# EAGLE design FPGA-Blitter (EAGLE 6.5.0)
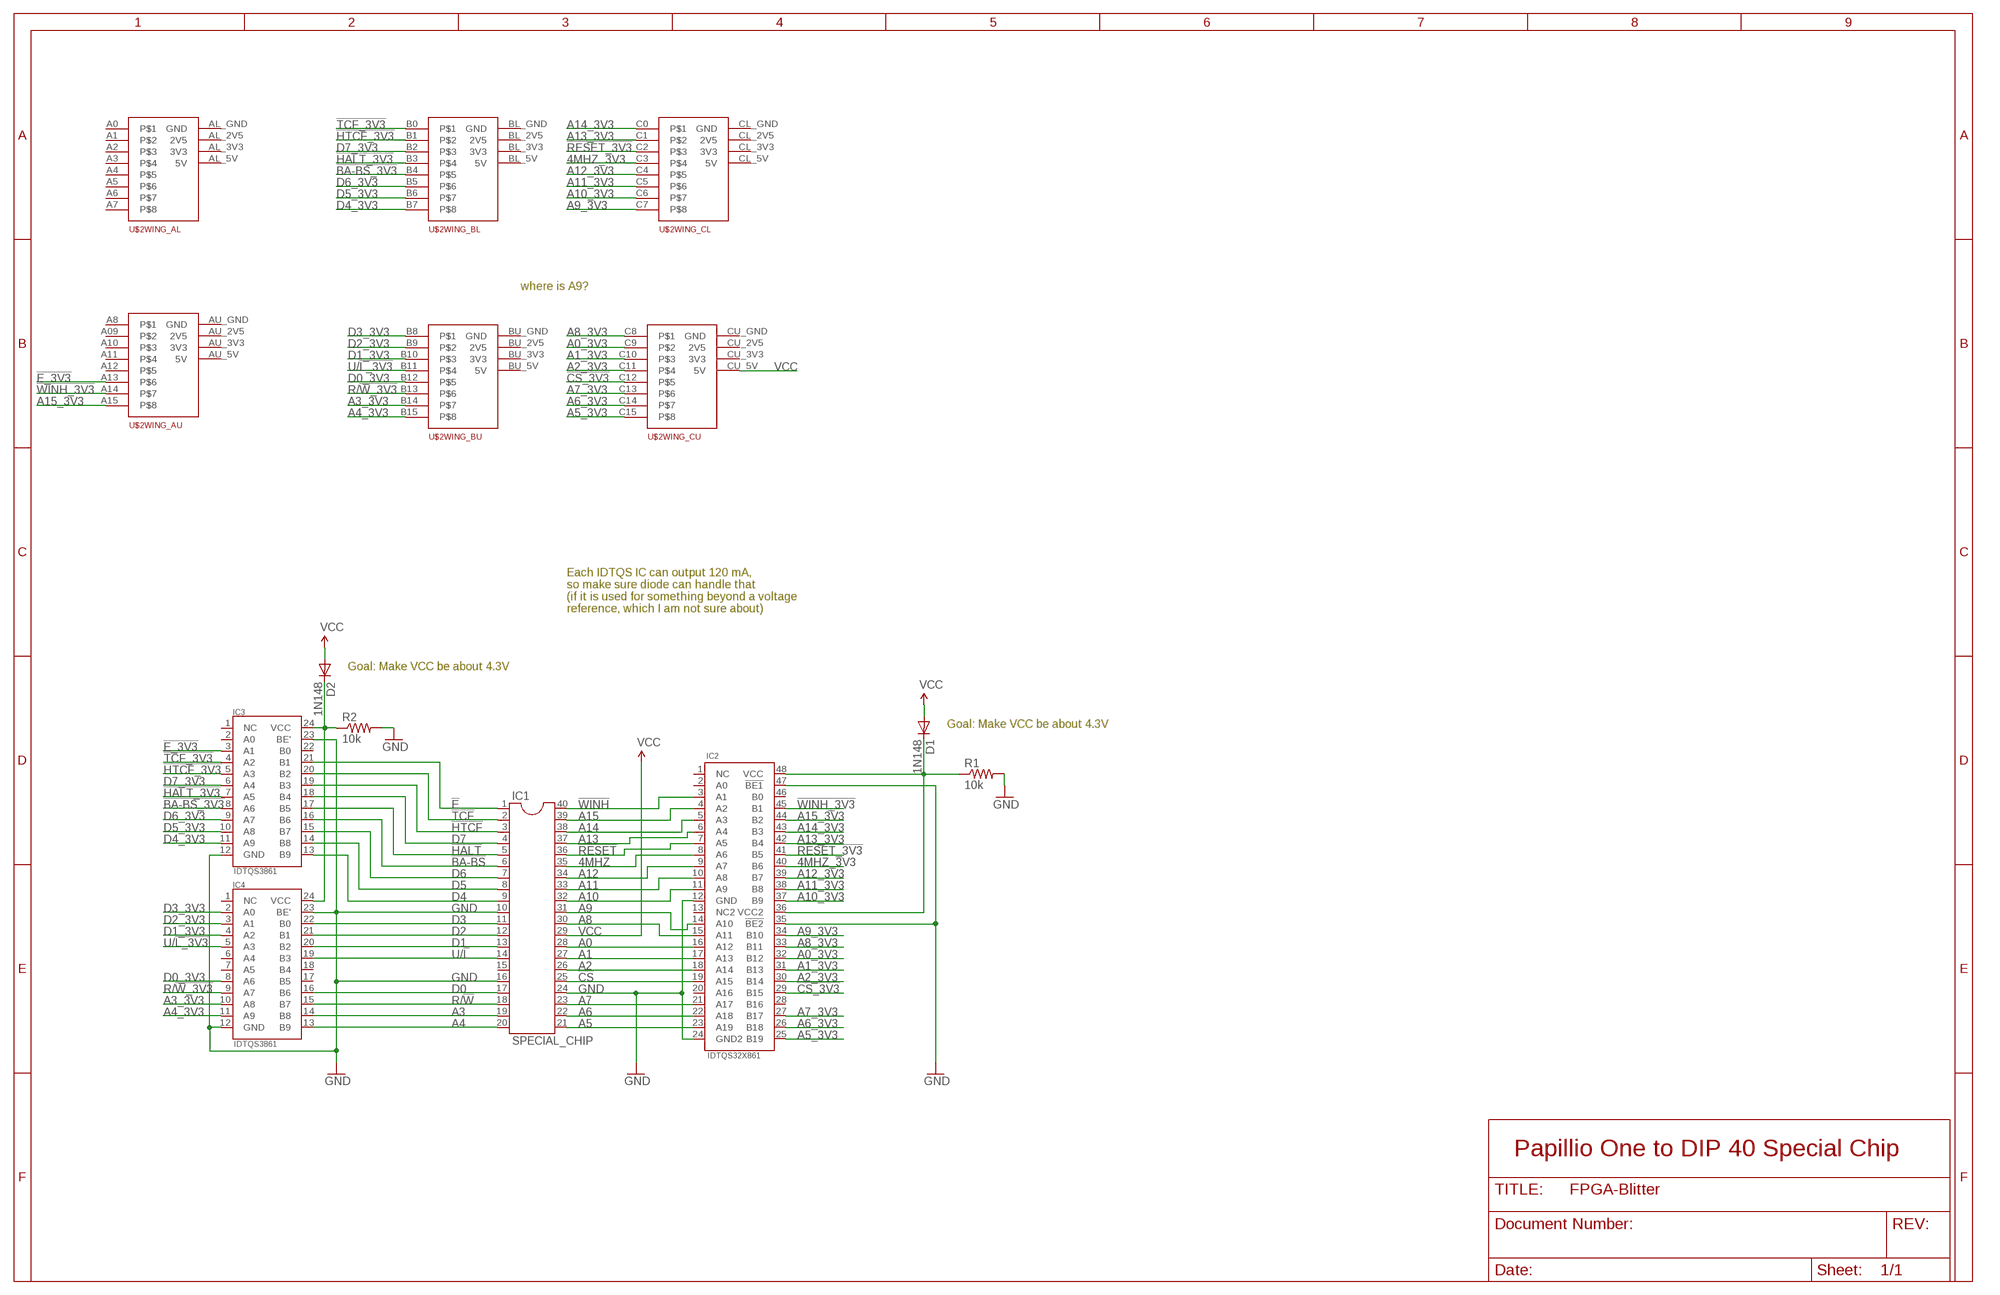
[diagram p0: schematic, sheet 1]

## Parts
D1  1N148  DIODE1N4148  [DIODE-1N4148]
D2  1N148  DIODE1N4148  [DIODE-1N4148]
IC1  SPECIAL_CHIP  DIL40  [DIL40]
IC2  IDTQS32X861  [QVSOP-DJG48-IDT]
IC3  IDTQS3861  [TSSOP24]
IC4  IDTQS3861  [TSSOP24]
R1  10k  RESISTOR1206  [1206]
R2  10k  RESISTOR1206  [1206]
U$2  PAPILIO48  [PAPILIO48]

## Nets
4MHZ: IC1.35 IC2.8(A6)
4MHZ_3V3: IC2.40(B6) U$2.C3
!BA-BS: IC1.6 IC3.16(B6)
!BA-BS_3V3: IC3.8(A6) U$2.B4
!CS: IC1.25 IC2.19(A15)
!CS_3V3: IC2.29(B15) U$2.C12
!E: IC1.1 IC3.21(B1)
!E_3V3: IC3.3(A1) U$2.A13
!HALT: IC1.5 IC3.17(B5)
!HALT_3V3: IC3.7(A5) U$2.B3
!HTCF: IC1.3 IC3.19(B3)
!HTCF_3V3: IC3.5(A3) U$2.B1
!RESET: IC1.36 IC2.7(A5)
!RESET_3V3: IC2.41(B5) U$2.C2
!TCF: IC1.2 IC3.20(B2)
!TCF_3V3: IC3.4(A2) U$2.B0
!WINH: IC1.40 IC2.3(A1)
!WINH_3V3: IC2.45(B1) U$2.A14
A0: IC1.28 IC2.16(A12)
A0_3V3: IC2.32(B12) U$2.C9
A1: IC1.27 IC2.17(A13)
A1_3V3: IC2.31(B13) U$2.C10
A2: IC1.26 IC2.18(A14)
A2_3V3: IC2.30(B14) U$2.C11
A3: IC1.19 IC4.14(B8)
A3_3V3: IC4.10(A8) U$2.B14
A4: IC1.20 IC4.13(B9)
A4_3V3: IC4.11(A9) U$2.B15
A5: IC1.21 IC2.23(A19)
A5_3V3: IC2.25(B19) U$2.C15
A6: IC1.22 IC2.22(A18)
A6_3V3: IC2.26(B18) U$2.C14
A7: IC1.23 IC2.21(A17)
A7_3V3: IC2.27(B17) U$2.C13
A8: IC1.30 IC2.15(A11)
A8_3V3: IC2.33(B11) U$2.C8
A9: IC1.31 IC2.14(A10)
A9_3V3: IC2.34(B10) U$2.C7
A10: IC1.32 IC2.11(A9)
A10_3V3: IC2.37(B9) U$2.C6
A11: IC1.33 IC2.10(A8)
A11_3V3: IC2.38(B8) U$2.C5
A12: IC1.34 IC2.9(A7)
A12_3V3: IC2.39(B7) U$2.C4
A13: IC1.37 IC2.6(A4)
A13_3V3: IC2.42(B4) U$2.C1
A14: IC1.38 IC2.5(A3)
A14_3V3: IC2.43(B3) U$2.C0
A15: IC1.39 IC2.4(A2)
A15_3V3: IC2.44(B2) U$2.A15
D0: IC1.17 IC4.16(B6)
D0_3V3: IC4.8(A6) U$2.B12
D1: IC1.13 IC4.20(B2)
D1_3V3: IC4.4(A2) U$2.B10
D2: IC1.12 IC4.21(B1)
D2_3V3: IC4.3(A1) U$2.B9
D3: IC1.11 IC4.22(B0)
D3_3V3: IC4.2(A0) U$2.B8
D4: IC1.9 IC3.13(B9)
D4_3V3: IC3.11(A9) U$2.B7
D5: IC1.8 IC3.14(B8)
D5_3V3: IC3.10(A8) U$2.B6
D6: IC1.7 IC3.15(B7)
D6_3V3: IC3.9(A7) U$2.B5
D7: IC1.4 IC3.18(B4)
D7_3V3: IC3.6(A4) U$2.B2
GND: IC1.10 IC1.16 IC1.24 IC2.12(GND) IC2.24(GND2) IC2.35(!BE2) IC2.47(!BE1) IC3.12(GND) IC3.23(BE') IC4.12(GND) IC4.23(BE') R1.2 R2.2
N$4: D2.C IC3.24(VCC) IC4.24(VCC) R2.1
N$8: D1.C IC2.36(VCC2) IC2.48(VCC) R1.1
R/!W: IC1.18 IC4.15(B7)
R/!W_3V3: IC4.9(A7) U$2.B13
U/!L: IC1.14 IC4.19(B3)
U/!L_3V3: IC4.5(A3) U$2.B11
VCC: D1.A D2.A IC1.29 U$2.CU_5V(WING_CU:5V)
Unconnected: IC1.15 IC2.1(NC) IC2.2(A0) IC2.13(NC2) IC2.20(A16) IC2.28(B16) IC2.46(B0) IC3.1(NC) IC3.2(A0) IC3.22(B0) IC4.1(NC) IC4.6(A4) IC4.7(A5) IC4.17(B5) IC4.18(B4) U$2.A0 U$2.A1 U$2.A2 U$2.A3 U$2.A4 U$2.A5 U$2.A6 U$2.A7 U$2.A8 U$2.A09 U$2.A10 U$2.A11 U$2.A12 U$2.AL_2V5(WING_AL:2V5) U$2.AL_3V3(WING_AL:3V3) U$2.AL_5V(WING_AL:5V) U$2.AL_GND(WING_AL:GND) U$2.AU_2V5(WING_AU:2V5) U$2.AU_3V3(WING_AU:3V3) U$2.AU_5V(WING_AU:5V) U$2.AU_GND(WING_AU:GND) U$2.BL_2V5(WING_BL:2V5) U$2.BL_3V3(WING_BL:3V3) U$2.BL_5V(WING_BL:5V) U$2.BL_GND(WING_BL:GND) U$2.BU_2V5(WING_BU:2V5) U$2.BU_3V3(WING_BU:3V3) U$2.BU_5V(WING_BU:5V) U$2.BU_GND(WING_BU:GND) U$2.CL_2V5(WING_CL:2V5) U$2.CL_3V3(WING_CL:3V3) U$2.CL_5V(WING_CL:5V) U$2.CL_GND(WING_CL:GND) U$2.CU_2V5(WING_CU:2V5) U$2.CU_3V3(WING_CU:3V3) U$2.CU_GND(WING_CU:GND)

## Notes on the sheet
- where is A9?
- Each IDTQS IC can output 120 mA,
  so make sure diode can handle that
  (if it is used for something beyond a voltage
  reference, which I am not sure about)
- Goal: Make VCC be about 4.3V
- Goal: Make VCC be about 4.3V
- Papillio One to DIP 40 Special Chip

## Library data of the parts
D1 D2 = SparkFun:DIODE: Diode These are standard reverse protection diodes and small signal diodes. SMA package can handle up to about 1A. SOD-323 can handle about 200mA. What the SOD-323 package when ordering, there are some mfgs out there that are 5-pin packages.
IC1 = ic-package:DIL40: Dual In Line
IC2 = mpo:IDTQS32X861
IC3 IC4 = mpo:IDTQS3861
R1 R2 = SparkFun:RESISTOR: Resistor Basic schematic elements and footprints for 0603, 1206, and PTH resistors.
U$2 = atom_pap:PAPILIO48: Papilio One Full Wing, Created by AtomSoft.

## Net classes
0 default: width 0.178 mm, drill 0.381 mm, clearance 0.178 mm
1 Power: width 0.813 mm, drill 0.381 mm, clearance 0.178 mm

## Board
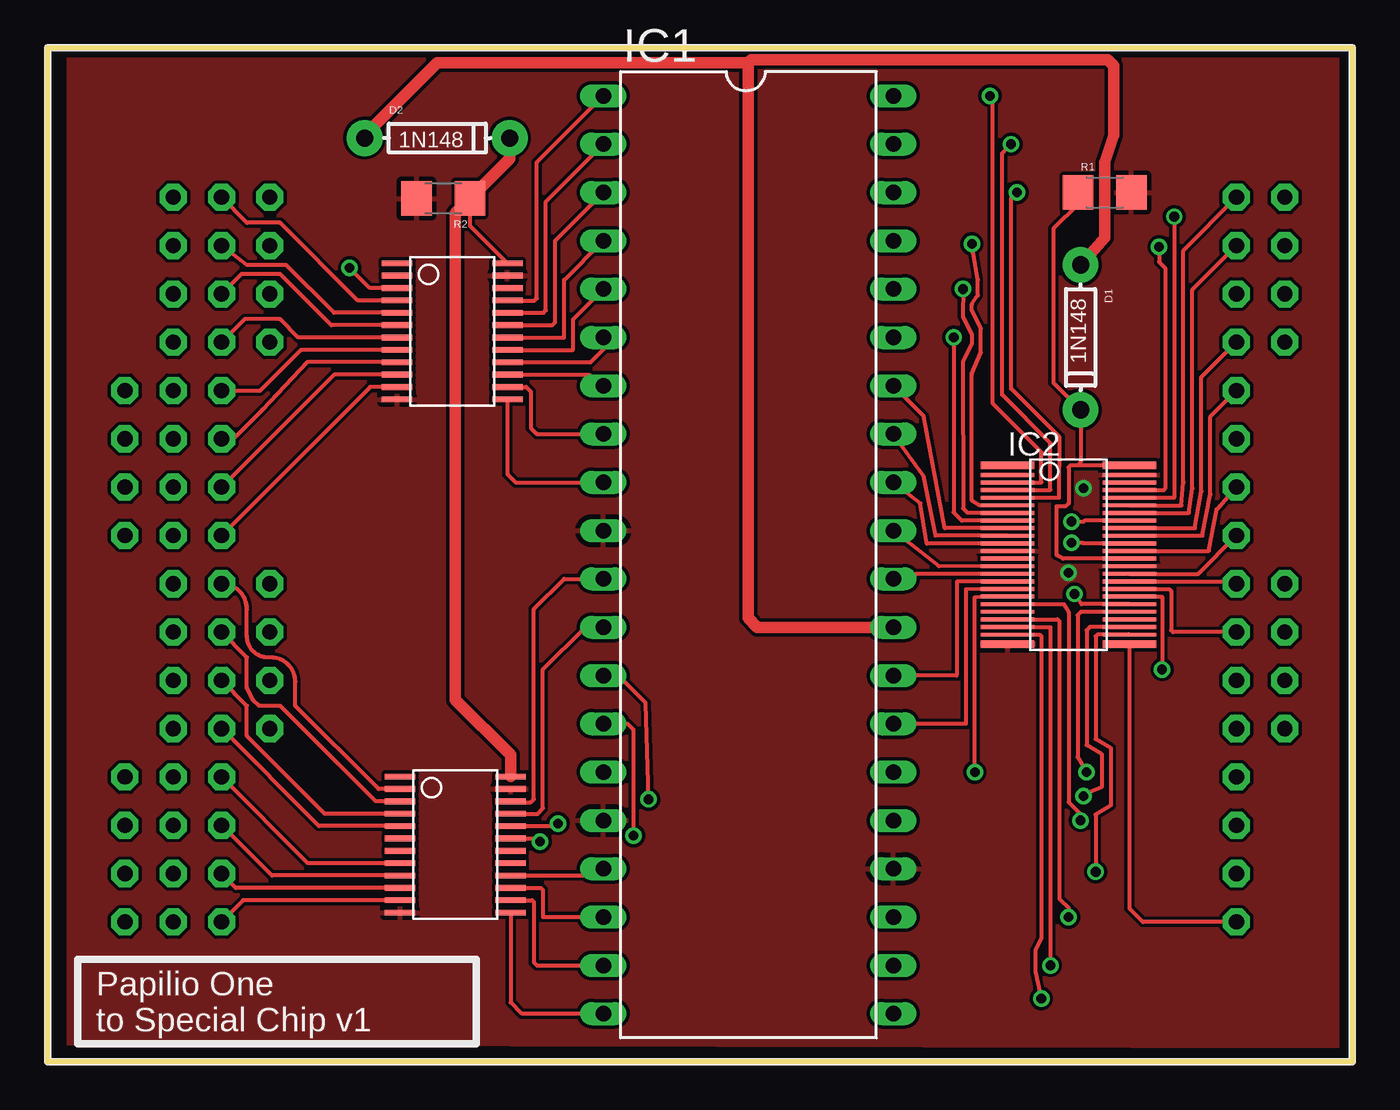
[diagram p1: board, top side]
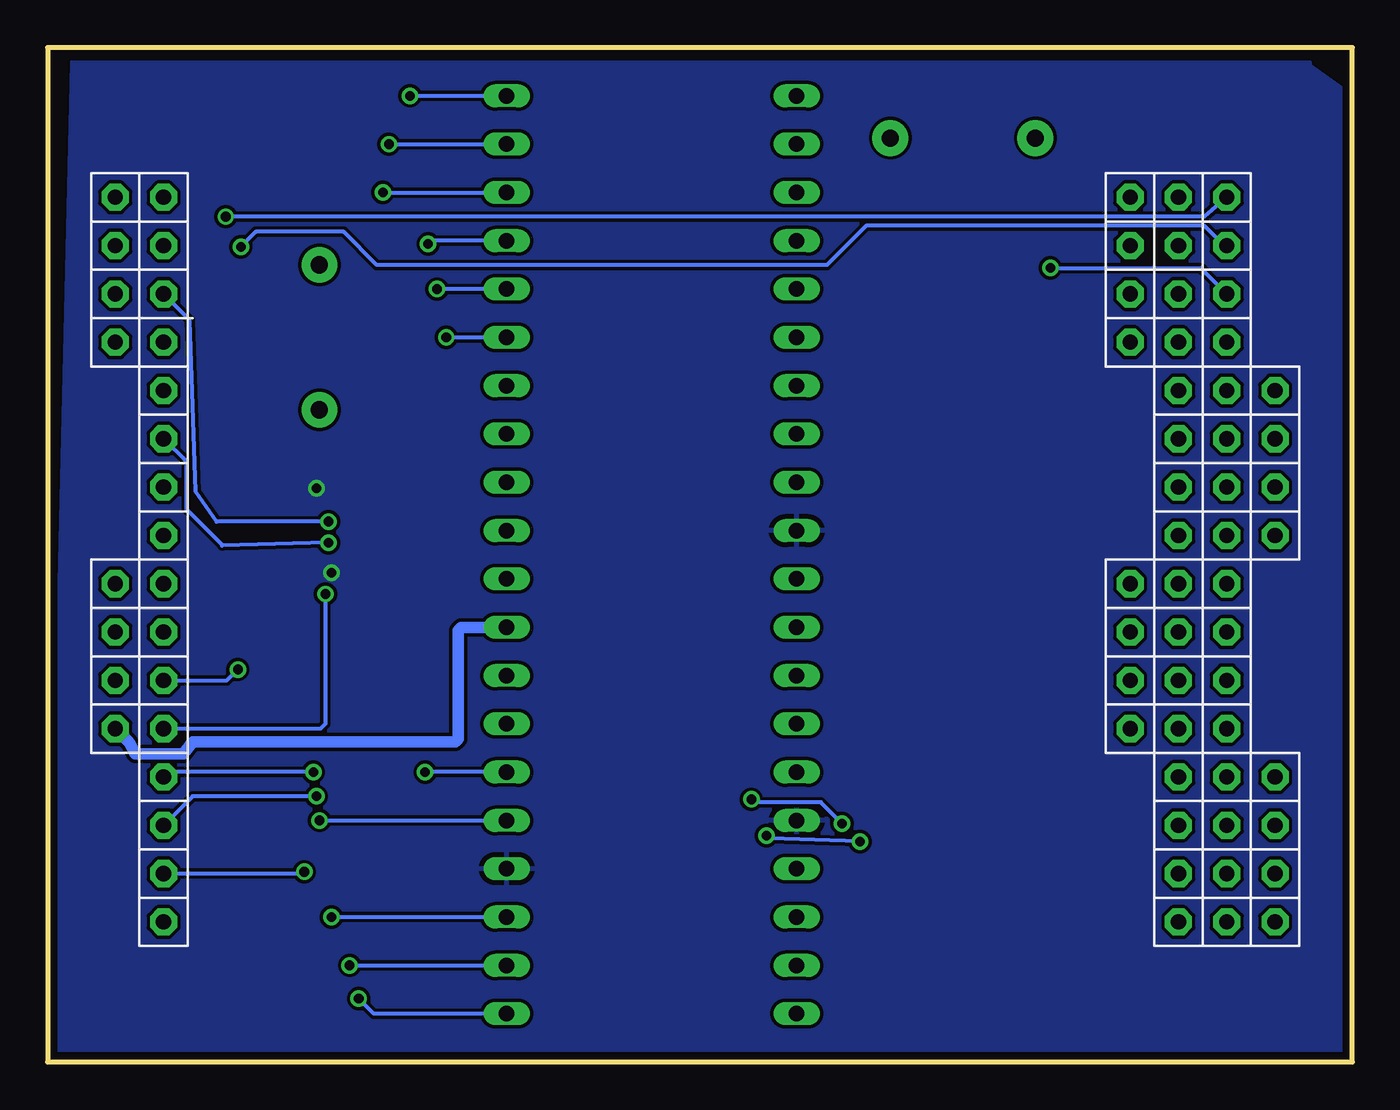
[diagram p2: board, bottom side, seen from below]

Size 68.58 x 53.34 mm. Coordinates in mm from the lower left corner, seen from the top.
Outline: 0,53.34 68.58,53.34 68.58,0 0,0 0,53.34
Copper layers (1*16): Top 0.0356mm / dielectric 1.5011mm / Bottom 0.0356mm
Design rules "OSHParkLaenPCBOrder": minimum track width 6mil, minimum drill 13mil, track to track 6mil, track to pad 6mil, pad to pad 6mil, via to via 6mil, smd to smd 6mil, copper to edge 15mil, drill to drill 6mil, minimum pad ring 7mil, minimum via ring 7mil, stop-mask expansion 3mil, vias tented up to drill 0mil, thermal gap 10mil

### Footprints (pad centres in the part's own frame; a part is rotated, then mirrored left to right if it is on the bottom)
DIODE-1N4148 = drill 0.9 pad 1.88: A -3.81,0; C 3.81,0
DIL40 = drill 0.813 long: 1 -24.13,-7.62; 2 -21.59,-7.62; 3 -19.05,-7.62; 4 -16.51,-7.62; 5 -13.97,-7.62; 6 -11.43,-7.62; 7 -8.89,-7.62; 8 -6.35,-7.62; 9 -3.81,-7.62; 10 -1.27,-7.62; 11 1.27,-7.62; 12 3.81,-7.62; 13 6.35,-7.62; 14 8.89,-7.62; 15 11.43,-7.62; 16 13.97,-7.62; 17 16.51,-7.62; 18 19.05,-7.62; 19 21.59,-7.62; 20 24.13,-7.62; 21 24.13,7.62; 22 21.59,7.62; 23 19.05,7.62; 24 16.51,7.62; 25 13.97,7.62; 26 11.43,7.62; 27 8.89,7.62; 28 6.35,7.62; 29 3.81,7.62; 30 1.27,7.62; 31 -1.27,7.62; 32 -3.81,7.62; 33 -6.35,7.62; 34 -8.89,7.62; 35 -11.43,7.62; 36 -13.97,7.62; 37 -16.51,7.62; 38 -19.05,7.62; 39 -21.59,7.62; 40 -24.13,7.62
QVSOP-DJG48-IDT = smd 0.4 x 2.8: 1 -4.7,-3.2; 24 4.7,-3.2; 25 4.7,3.2; 48 -4.7,3.2 | smd 0.2 x 2.8: 2 -4.2,-3.2; 3 -3.8,-3.2; 4 -3.4,-3.2; 5 -3,-3.2; 6 -2.6,-3.2; 7 -2.2,-3.2; 8 -1.8,-3.2; 9 -1.4,-3.2; 10 -1,-3.2; 11 -0.6,-3.2; 12 -0.2,-3.2; 13 0.2,-3.2; 14 0.6,-3.2; 15 1,-3.2; 16 1.4,-3.2; 17 1.8,-3.2; 18 2.2,-3.2; 19 2.6,-3.2; 20 3,-3.2; 21 3.4,-3.2; 22 3.8,-3.2; 23 4.2,-3.2; 26 4.2,3.2; 27 3.8,3.2; 28 3.4,3.2; 29 3,3.2; 30 2.6,3.2; 31 2.2,3.2; 32 1.8,3.2; 33 1.4,3.2; 34 1,3.2; 35 0.6,3.2; 36 0.2,3.2; 37 -0.2,3.2; 38 -0.6,3.2; 39 -1,3.2; 40 -1.4,3.2; 41 -1.8,3.2; 42 -2.2,3.2; 43 -2.6,3.2; 44 -3,3.2; 45 -3.4,3.2; 46 -3.8,3.2; 47 -4.2,3.2
TSSOP24 = smd 0.3 x 1.6: 1 -3.575,-2.9; 2 -2.925,-2.9; 3 -2.275,-2.9; 4 -1.625,-2.9; 5 -0.975,-2.9; 6 -0.325,-2.9; 7 0.325,-2.9; 8 0.975,-2.9; 9 1.625,-2.9; 10 2.275,-2.9; 11 2.925,-2.9; 12 3.575,-2.9; 13 3.575,2.9; 14 2.925,2.9; 15 2.275,2.9; 16 1.625,2.9; 17 0.975,2.9; 18 0.325,2.9; 19 -0.325,2.9; 20 -0.975,2.9; 21 -1.625,2.9; 22 -2.275,2.9; 23 -2.925,2.9; 24 -3.575,2.9
1206 = smd 1.6 x 1.8: 1 -1.4,0; 2 1.4,0
PAPILIO48 = drill 0.8 pad 1.422 octagon: A0 32.766,-20.574; A1 32.766,-18.034; A2 32.766,-15.494; A3 32.766,-12.954; A4 32.766,-10.414; A5 32.766,-7.874; A6 32.766,-5.334; A7 32.766,-2.794; A8 32.766,-0.254; A09 32.766,2.286; A10 32.766,4.826; A11 32.766,7.366; A12 32.766,9.906; A13 32.766,12.446; A14 32.766,14.986; A15 32.766,17.526; AL_2V5 35.306,-18.034; AL_3V3 35.306,-15.494; AL_5V 35.306,-12.954; AL_GND 35.306,-20.574; AU_2V5 35.306,2.286; AU_3V3 35.306,4.826; AU_5V 35.306,7.366; AU_GND 35.306,-0.254; B0 30.226,17.526; B1 30.226,14.986; B2 30.226,12.446; B3 30.226,9.906; B4 30.226,7.366; B5 30.226,4.826; B6 30.226,2.286; B7 30.226,-0.254; B8 30.226,-2.794; B9 30.226,-5.334; B10 30.226,-7.874; B11 30.226,-10.414; B12 30.226,-12.954; B13 30.226,-15.494; B14 30.226,-18.034; B15 30.226,-20.574; BL_2V5 27.686,14.986; BL_3V3 27.686,12.446; BL_5V 27.686,9.906; BL_GND 27.686,17.526; BU_2V5 27.686,-5.334; BU_3V3 27.686,-7.874; BU_5V 27.686,-10.414; BU_GND 27.686,-2.794; C0 -23.114,17.526; C1 -23.114,14.986; C2 -23.114,12.446; C3 -23.114,9.906; C4 -23.114,7.366; C5 -23.114,4.826; C6 -23.114,2.286; C7 -23.114,-0.254; C8 -23.114,-2.794; C9 -23.114,-5.334; C10 -23.114,-7.874; C11 -23.114,-10.414; C12 -23.114,-12.954; C13 -23.114,-15.494; C14 -23.114,-18.034; C15 -23.114,-20.574; CL_2V5 -25.654,14.986; CL_3V3 -25.654,12.446; CL_5V -25.654,9.906; CL_GND -25.654,17.526; CU_2V5 -25.654,-5.334; CU_3V3 -25.654,-7.874; CU_5V -25.654,-10.414; CU_GND -25.654,-2.794

### Placement (x,y rotation side)
D1  54.29,38.1 270 top
D2  20.48,48.58 0 top
IC1  36.83,26.67 270 top
IC2  53.66,26.67 270 top
IC3  21.27,38.42 270 top
IC4  21.43,11.43 270 top
R1  55.56,45.72 0 top
R2  20.8,45.4 180 top
U$2  39.37,27.94 0 bottom

### Tracks (layer width: path | path; a pad name or v marks a point on that pad's centre or on a via)
4MHZ  (via drill 0.51)
  Top 0.203: IC2.8 48.05,28.47 47.62,28.89 v47.62,38.1
  Bottom 0.203: IC1.35 v47.62,38.1
4MHZ_3V3
  Top 0.203: IC2.40 60.3,28.07 60.64,30 60.64,36.01 U$2.C3
!BA-BS
  Top 0.203: IC3.16 28.54,36.79 29.21,37.47 IC1.6
!BA-BS_3V3
  Top 0.203: IC3.8 13.31,37.44 11.18,35.31 U$2.B4
!CS  (via drill 0.51)
  Top 0.203: IC2.19 53.4,24.07 53.66,23.65 53.66,13.65 54.29,13.02 v54.29,12.7
  Bottom 0.203: v54.29,12.7 IC1.25
!CS_3V3  (via drill 0.51)
  Top 0.203: IC2.29 54.31,23.67 54.13,23.5 54.13,16.03 v54.61,15.24
  Bottom 0.203: v54.61,15.24 62.23,15.24 U$2.C12
!E
  Top 0.203: IC3.21 25.6,40.04 25.72,40.16 25.72,47.31 IC1.1
!E_3V3  (via drill 0.51)
  Top 0.203: IC3.3 16.93,40.69 v15.88,41.75
  Bottom 0.203: v15.88,41.75 7.94,41.75 7.78,41.56 U$2.A13
!HALT
  Top 0.203: IC3.17 27.6,37.44 27.62,37.47 27.62,39.05 IC1.5
!HALT_3V3
  Top 0.203: IC3.7 13.18,38.09 12.22,39.05 10.35,39.05 U$2.B3
!HTCF
  Top 0.203: IC3.19 26.52,38.74 26.67,38.89 26.67,43.18 IC1.3
!HTCF_3V3
  Top 0.203: IC3.5 15.06,39.39 12.54,41.91 10.48,41.91 U$2.B1
!RESET  (via drill 0.51)
  Top 0.203: IC2.7 48.35,28.87 48.12,29.11 48.1,36.83 48.58,37.78 48.58,38.26 48.1,39.21 v48.12,40.64
  Bottom 0.203: IC1.36 v48.12,40.64
!RESET_3V3  (via drill 0.51)
  Top 0.203: IC2.41 54.51,28.47 54.45,28.42 v53.82,28.42
  Bottom 0.203: v53.82,28.42 59.69,28.42 60.8,30 61.12,39.02 U$2.C2
!TCF
  Top 0.203: IC3.20 26.06,39.39 26.19,39.53 26.19,45.24 IC1.2
!TCF_3V3
  Top 0.203: IC3.4 16.31,40.04 12.22,44.13 10.48,44.13 U$2.B0
!WINH  (via drill 0.51)
  Top 0.203: IC2.3 52.23,30.48 52.23,32.07 49.69,34.61 49.69,50.64 v49.53,50.8
  Bottom 0.203: v49.53,50.8 IC1.40
!WINH_3V3  (via drill 0.51)
  Top 0.203: IC2.45 58.65,30.07 58.74,30.16 58.74,41.75 58.42,42.07 v58.42,42.86
  Bottom 0.203: U$2.A14 6.73,42.93 7.78,43.97 25.56,43.97 27.62,41.91 51.28,41.91 53.02,43.66 57.63,43.66 v58.42,42.86
A0
  Top 0.203: IC2.16 47.8,25.26 47.78,20.32 IC1.28
A0_3V3
  Top 0.203: U$2.C9 59.15,22.61 59.05,22.7 59.05,24.77 58.95,24.87 IC2.32
A1
  Top 0.203: IC2.17 48.26,24.85 48.26,17.78 IC1.27
A1_3V3  (via drill 0.51)
  Top 0.203: IC2.31 58.56,24.47 58.58,24.45 v58.58,20.64
  Bottom 0.203: U$2.C10 59.15,20.07 v58.58,20.64
A2  (via drill 0.51)
  Top 0.203: v48.74,15.24 48.74,24.45 IC2.18
  Bottom 0.203: IC1.26 v48.74,15.24
A2_3V3  (via drill 0.51)
  Top 0.203: IC2.30 54.35,24.07 v53.98,24.61
  Bottom 0.203: v53.98,24.61 53.98,17.78 54.23,17.53 U$2.C11
A3
  Top 0.203: IC4.14 25.47,8.51 25.56,8.41 25.56,5.24 25.72,5.08 IC1.19
A3_3V3
  Top 0.203: IC4.10 9.89,9.15 U$2.B14
A4
  Top 0.203: IC1.20 24.92,2.54 24.33,3.13 IC4.13
A4_3V3
  Top 0.203: IC4.11 10.28,8.51 U$2.B15
A5  (via drill 0.51)
  Top 0.203: IC2.23 52.14,22.47 52.23,22.38 52.23,6.51 51.91,5.87 51.91,4.76 v52.23,3.33
  Bottom 0.203: IC1.21 51.44,2.54 v52.23,3.33
A5_3V3
  Top 0.203: IC2.25 56.86,8.07 57.56,7.37 U$2.C15
A6  (via drill 0.51)
  Top 0.203: IC2.22 52.7,22.87 52.7,22.86 v52.7,5.08
  Bottom 0.203: v52.7,5.08 IC1.22
A6_3V3  (via drill 0.51)
  Top 0.203: IC2.26 55.17,22.47 55.09,22.38 55.09,16.99 55.88,16.51 55.88,13.49 55.09,13.02 v55.09,10
  Bottom 0.203: U$2.C14 55.18,9.91 v55.09,10
A7  (via drill 0.51)
  Top 0.203: IC2.21 53.09,23.27 53.18,23.18 53.18,8.57 53.66,8.1 v53.66,7.62
  Bottom 0.203: v53.66,7.62 IC1.23
A7_3V3  (via drill 0.51)
  Top 0.203: IC2.27 54.78,22.87 54.61,22.7 54.61,16.67 55.4,16.19 55.4,14.45 54.61,14.13 v54.45,13.97
  Bottom 0.203: v54.45,13.97 60.96,13.97 U$2.C13
A8
  Top 0.203: IC2.15 45.65,25.66 IC1.30
A8_3V3
  Top 0.203: IC2.33 62.36,25.27 U$2.C8
A9
  Top 0.203: IC2.14 46.85,26.07 IC1.31
A9_3V3
  Top 0.203: IC2.34 60.47,25.67 U$2.C7
A10
  Top 0.203: IC2.11 46.22,27.25 45.88,29.37 IC1.32
A10_3V3
  Top 0.203: IC2.37 61.03,26.87 61.44,29.05 61.59,29.21 U$2.C6
A11
  Top 0.203: IC2.10 46.68,27.67 46.04,30.8 IC1.33
A11_3V3  (via drill 0.51)
  Top 0.203: IC2.38 54.42,27.27 54.38,27.3 v53.82,27.3
  Bottom 0.203: v53.82,27.3 59.4,27.15 59.4,27.18 61.28,29.05 61.28,31.56 U$2.C5
A12
  Top 0.203: IC2.9 47.16,28.07 46.04,33.97 IC1.34
A12_3V3
  Top 0.203: IC2.39 60.69,27.67 61.12,29.84 61.12,33.94 U$2.C4
A13  (via drill 0.51)
  Top 0.203: v48.58,43.02 48.9,41.12 48.9,40.32 48.58,39.85 48.58,39.53 49.05,38.58 49.05,37.31 48.58,36.2 48.58,29.53 48.99,29.27 IC2.6
  Bottom 0.203: IC1.37 48.42,43.18 v48.58,43.02
A13_3V3
  Top 0.203: IC2.42 59.98,28.87 60.17,30.16 60.17,40.61 U$2.C1
A14  (via drill 0.51)
  Top 0.203: IC2.5 53.16,29.68 53.19,32.86 50.64,35.4 50.64,45.4 v50.96,45.72
  Bottom 0.203: v50.96,45.72 IC1.38
A14_3V3
  Top 0.203: IC2.43 59.59,29.27 59.69,30.48 59.69,42.67 U$2.C0
A15  (via drill 0.51)
  Top 0.203: IC2.4 52.7,30.09 52.7,32.49 52.7,32.54 50.16,35.08 50.16,47.78 v50.64,48.26
  Bottom 0.203: v50.64,48.26 IC1.39
A15_3V3  (via drill 0.51)
  Top 0.203: IC2.44 59.2,29.67 59.21,29.69 v59.21,44.45
  Bottom 0.203: U$2.A15 7.78,44.45 v59.21,44.45
D0
  Top 0.203: IC4.16 28.86,9.8 IC1.17
D0_3V3
  Top 0.203: IC4.8 13.68,10.46 U$2.B12
D1  (via drill 0.51)
  Top 0.203: IC4.20 26.69,12.4 v26.83,12.54 | v31.59,13.81 31.43,18.89 30,20.32 IC1.13
  Bottom 0.203: v26.83,12.54 27.94,13.65 31.27,13.65 v31.59,13.81
D1_3V3
  Top 0.203: IC4.4 14.57,13.05 10.48,17.14 10.48,18.73 U$2.B10
D2
  Top 0.203: IC4.21 25.75,13.05 26.04,13.34 26.04,20.64 28.26,22.86 IC1.12
D2_3V3
  Top 0.203: IC4.3 17.25,13.71 12.22,18.73 11.11,18.73 10.79,19.05 10.48,19.68 10.48,21.27 U$2.B9
D3
  Top 0.203: IC4.22 24.33,13.7 24.29,13.65 25.4,13.65 25.56,13.81 25.56,23.81 27.15,25.4 IC1.11
D3_3V3
  Top 0.203: IC4.2 17.39,14.36 13.02,18.73 13.02,20 arc90 11.75,21.27 11.59,21.27 arc-90 10.48,22.38 10.48,23.81 arc90 U$2.B8
D4
  Top 0.203: IC3.13 24.17,30.91 24.61,30.48 IC1.9
D4_3V3
  Top 0.203: IC3.11 16.95,35.49 U$2.B7
D5
  Top 0.203: IC3.14 25.15,35.49 25.4,35.24 25.4,33.34 25.72,33.02 IC1.8
D5_3V3
  Top 0.203: IC3.10 15.06,36.14 U$2.B6
D6
  Top 0.203: IC3.15 28.47,36.14 28.57,36.04 28.73,36.04 IC1.7
D6_3V3
  Top 0.203: IC3.9 13.65,36.79 11.27,34.29 9.75,32.77 U$2.B5
D7
  Top 0.203: IC3.18 27.14,38.09 27.15,38.1 27.15,41.12 IC1.4
D7_3V3
  Top 0.203: IC3.6 14.91,38.74 12.22,41.43 10.19,41.43 U$2.B2
GND  (via drill 0.51)
  other vias: 54.45,30.16 53.66,25.72
  pour Top: 1.11,0.95 1.11,53.02 67.79,53.02 67.79,0.79 2.54,0.95
  pour Bottom: 0,0 0,50.8 2.22,52.39 2.22,52.55 67.31,52.55 68.58,0
N$4
  Top 0.203: R2.1 22.2,43.97 IC3.24
  Top 0.61: IC4.24 24.33,16.15 21.43,19.05 21.43,44.64 R2.1 24.29,47.49 D2.C
N$8
  Top 0.203: IC2.48 54.13,31.37 | 54.13,31.37 53.75,31.37 53.66,31.27 53.66,29.37 53.5,29.21 53.02,29.21 53.02,26.67 53.38,26.47 IC2.36 | 54.13,31.37 54.29,31.53 D1.C 52.86,35.72 52.86,43.81 54.16,45.11 R1.1
R/!W
  Top 0.203: IC4.15 25.93,9.15 26.04,9.05 26.04,7.62 IC1.18
R/!W_3V3
  Top 0.203: IC4.9 11.79,9.8 U$2.B13
U/!L  (via drill 0.51)
  Top 0.203: v30.8,11.91 30.8,17.46 30.48,17.78 IC1.14 | IC4.19 25.71,11.76 v25.88,11.59
  Bottom 0.203: v25.88,11.59 30.64,11.75 v30.8,11.91
U/!L_3V3
  Top 0.203: IC4.5 14.27,12.4 U$2.B11
VCC
  Top 0.61: IC1.29 37.31,22.86 36.83,23.34 36.83,52.55 | D1.A 55.56,43.34 55.56,47.31 56.04,48.74 56.04,52.39 55.72,52.7 36.99,52.7 36.83,52.55 | D2.A 16.67,48.74 20.48,52.55 36.83,52.55
  Bottom 0.61: IC1.29 46.83,22.86 46.99,22.7 46.99,16.99 47.15,16.83 60.96,16.83 61.44,16.19 63.98,16.19 64.29,16.8 U$2.CU_5V

### Text on the board
tPlace: Papilio One / to Special Chip v1